# Altium schematic sheet Motor_Encoders.SchDoc
size A4
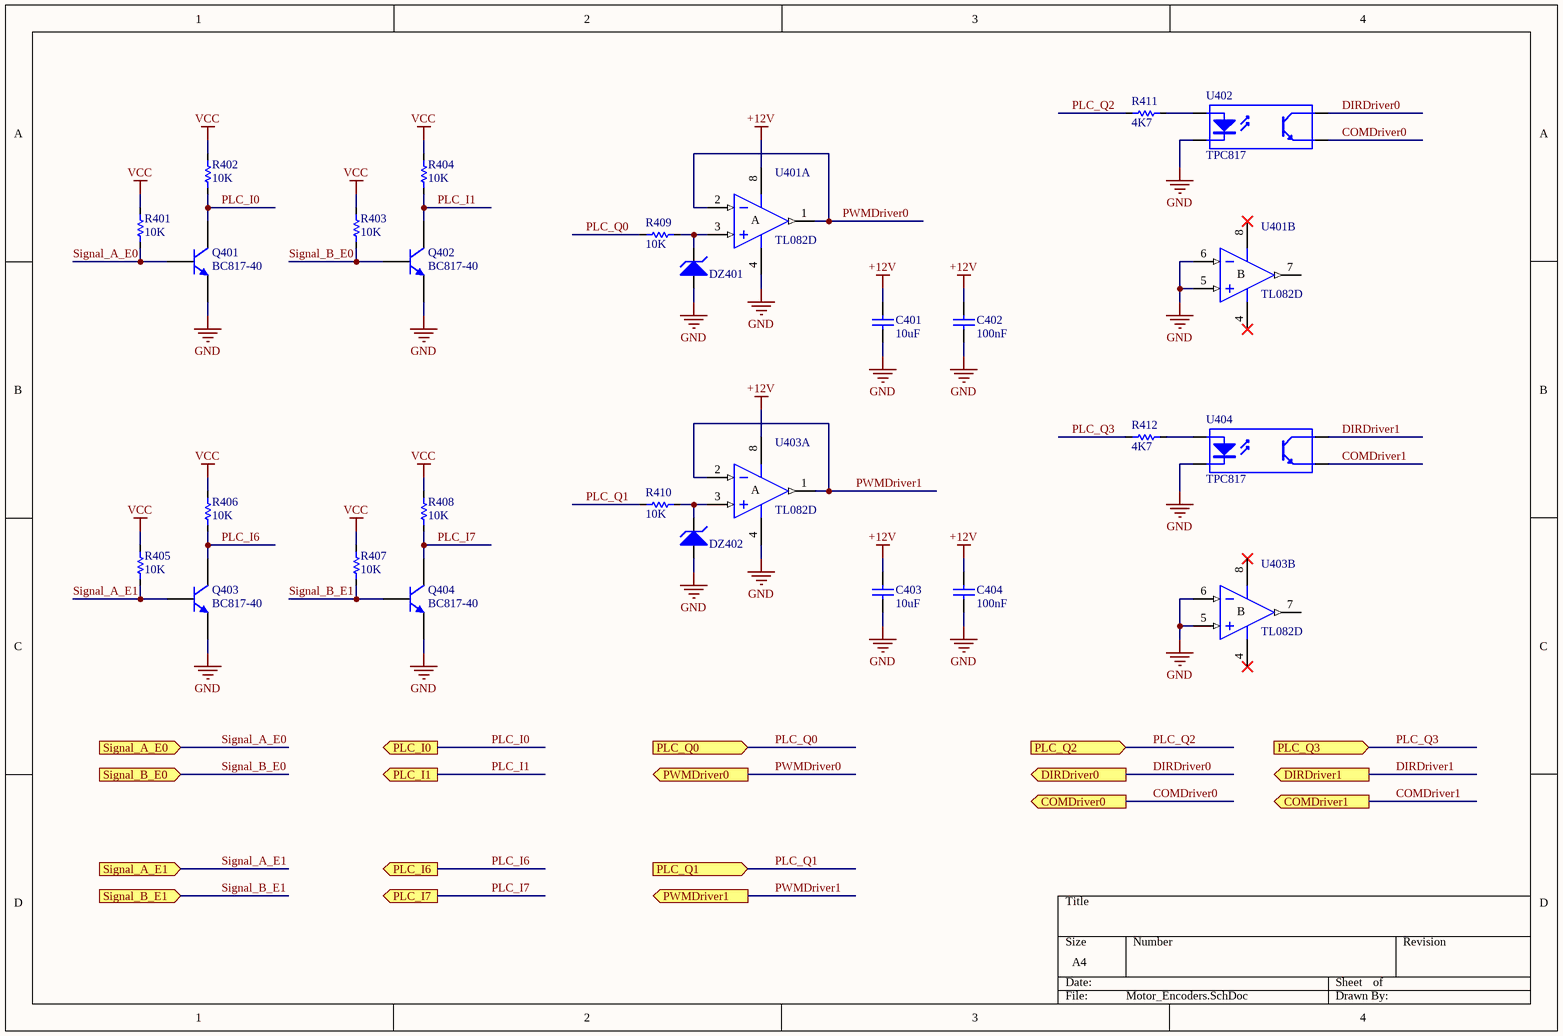
[diagram p0: Motor_Encoders.SchDoc]

## Parts
C401  VALOR: 10uF  [C0603]  (hidden comment: Cap Ceramico SMD)
C402  VALOR: 100nF  [C0603]  (hidden comment: Cap Ceramico SMD)
C403  VALOR: 10uF  [C0603]  (hidden comment: Cap Ceramico SMD)
C404  VALOR: 100nF  [C0603]  (hidden comment: Cap Ceramico SMD)
DZ401  Diodo Zenner SMD  [SOD-80]  (value not drawn)
DZ402  Diodo Zenner SMD  [SOD-80]  (value not drawn)
Q401  BC817-40  [SOT23_M]
Q402  BC817-40  [SOT23_M]
Q403  BC817-40  [SOT23_M]
Q404  BC817-40  [SOT23_M]
R401  VALOR: 10K  [R0603]  (hidden comment: Res SMD)
R402  VALOR: 10K  [R0603]  (hidden comment: Res SMD)
R403  VALOR: 10K  [R0603]  (hidden comment: Res SMD)
R404  VALOR: 10K  [R0603]  (hidden comment: Res SMD)
R405  VALOR: 10K  [R0603]  (hidden comment: Res SMD)
R406  VALOR: 10K  [R0603]  (hidden comment: Res SMD)
R407  VALOR: 10K  [R0603]  (hidden comment: Res SMD)
R408  VALOR: 10K  [R0603]  (hidden comment: Res SMD)
R409  VALOR: 10K  [R0603]  (hidden comment: Res SMD)
R410  VALOR: 10K  [R0603]  (hidden comment: Res SMD)
R411  VALOR: 4K7  [R0603]  (hidden comment: Res SMD)
R412  VALOR: 4K7  [R0603]  (hidden comment: Res SMD)
U401  TL082D  [D008_L]  (parts A,B of 2)
U402  TPC817  [DIP-4]
U403  TL082D  [D008_L]  (parts A,B of 2)
U404  TPC817  [DIP-4]

## Ports
COMDriver0 (out), COMDriver1 (out), DIRDriver0 (out), DIRDriver1 (out), PLC_I0 (out), PLC_I1 (out), PLC_I6 (out), PLC_I7 (out), PLC_Q0 (in), PLC_Q1 (in), PLC_Q2 (in), PLC_Q3 (in), PWMDriver0 (out), PWMDriver1 (out), Signal_A_E0 (in), Signal_A_E1 (in), Signal_B_E0 (in), Signal_B_E1 (in)

## Nets
+12V: C401.1 C402.1 C403.1 C404.1 U401.8(V+) U403.8(V+)
GND: C401.2 C402.2 C403.2 C404.2 DZ401.1(A) DZ402.1(A) Q401.2(E) Q402.2(E) Q403.2(E) Q404.2(E) U401.4(V-) U401.5(IN+) U401.6(IN-) U402.2(K) U403.4(V-) U403.5(IN+) U403.6(IN-) U404.2(K)
VCC: R401.1 R402.1 R403.1 R404.1 R405.1 R406.1 R407.1 R408.1
COMDriver0: U402.3(E) ; port COMDriver0
COMDriver1: U404.3(E) ; port COMDriver1
DIRDriver0: U402.4(C) ; port DIRDriver0
DIRDriver1: U404.4(C) ; port DIRDriver1
PLC_I0: Q401.3(C) R402.2 ; port PLC_I0
PLC_I1: Q402.3(C) R404.2 ; port PLC_I1
PLC_I6: Q403.3(C) R406.2 ; port PLC_I6
PLC_I7: Q404.3(C) R408.2 ; port PLC_I7
PLC_Q0: R409.1 ; port PLC_Q0
PLC_Q1: R410.1 ; port PLC_Q1
PLC_Q2: R411.2 ; port PLC_Q2
PLC_Q3: R412.2 ; port PLC_Q3
PWMDriver0: U401.1(OUT) U401.2(IN-) ; port PWMDriver0
PWMDriver1: U403.1(OUT) U403.2(IN-) ; port PWMDriver1
Signal_A_E0: Q401.1(B) R401.2 ; port Signal_A_E0
Signal_A_E1: Q403.1(B) R405.2 ; port Signal_A_E1
Signal_B_E0: Q402.1(B) R403.2 ; port Signal_B_E0
Signal_B_E1: Q404.1(B) R407.2 ; port Signal_B_E1
NetDZ401_2: DZ401.2(K) R409.2 U401.3(IN+)
NetDZ402_2: DZ402.2(K) R410.2 U403.3(IN+)
NetR411_1: R411.1 U402.1(A)
NetR412_1: R412.1 U404.1(A)

Not connected (* = marked no-connect by the designer): U401 7(OUT); U403 7(OUT)

## Notes on the sheet
- (in symbol TL082D, part A) A
- (in symbol TL082D, part B) B

## Library data of the parts
C401-C404 = Cap Ceramico SMD: Cap Ceramico SMD 0805; CODIGO RUF: *; PROVEEDOR: *; FABRICANTE: *
  C401 C403: Arrow: CL10A106MQ8NNNC; Digikey: 1276-1119-1-ND
  C402 C404: Arrow: C0603C104K5RACAUTO; Digikey: 399-6856-1-ND
Q401-Q404 = BC817-40: NPN General-purpose Transistor; Published: 17-Sep-2003; LatestRevisionDate: 12-Dec-2006; LatestRevisionNote: IPC-7351 Footprint Added.; DatasheetVersion: Jun-1999; PackageVersion: May-1999; PackageReference: SOT23; Publisher: Altium Limited; PackageDescription: 3-Pin SOT-23 Package 0.95 mm Pitch, 2.3 mm Lead Span; ComponentLink1Description: Manufacturer Link; ComponentLink1URL: http://www.semiconductors.philips.com/; ComponentLink2Description: Datasheet; ComponentLink2URL: http://www.semiconductors.philips.com/acrobat/datasheets/BC817_BC817W_BC337_5.pdf; Arrow: BC817-25-TP; Digikey: BC817-25-TPMSCT-ND
U401 U403 = TL082D: JFET-Input Operational Amplifier; Published: 16-Jan-2001; LatestRevisionDate: 13-Apr-2006; LatestRevisionNote: IPC-7351 Footprint Added.; DatasheetVersion: Feb-1999; PackageVersion: Jan-1998; PackageReference: D008; Publisher: Altium Limited; PackageDescription: 8-Pin Small Outline Integrated Circuit 1.27 mm Pitch; Code_IPC: SOIC127P600-8; ComponentLink1Description: Manufacturer Link; ComponentLink1URL: http://www.ti.com/; ComponentLink2Description: Datasheet; ComponentLink2URL: http://www-s.ti.com/sc/ds/tl082.pdf; Arrow: TL082IDR; Digikey: 296-15005-1-ND
U402 U404 = Optoisolator1: 4-Pin Phototransistor Optocoupler; Published: 24-Mar-1999; LatestRevisionDate: 04-Mar-2005; LatestRevisionNote: Sch pins 3 & 4 Swapped.; DatasheetVersion: Nov-2003; PackageReference: DIP-4; Publisher: Altium Limited; Arrow: TPC817MB C9G; Digikey: TPC817MBC9G-ND
DZ401 DZ402 = Diodo Zenner SMD: VALOR: *; PROVEEDOR: *; CODIGO RUF: *; FABRICANTE: *; Arrow: TLZ10C-GS08; Digikey: 112-TLZ10C-GS08CT-ND
R401-R412 = Res SMD: CODIGO RUF: *; PROVEEDOR: *; FABRICANTE: *
  R401-R410: Arrow: MCT06030C1002FP500; Digikey: RMCF0603FT10K0CT-ND
  R411 R412: Arrow: RC0805FR-074K7L; Digikey: 311-4.70KCRCT-ND